# Altium project PressurePulse_Pulse-PCB.PrjPcb
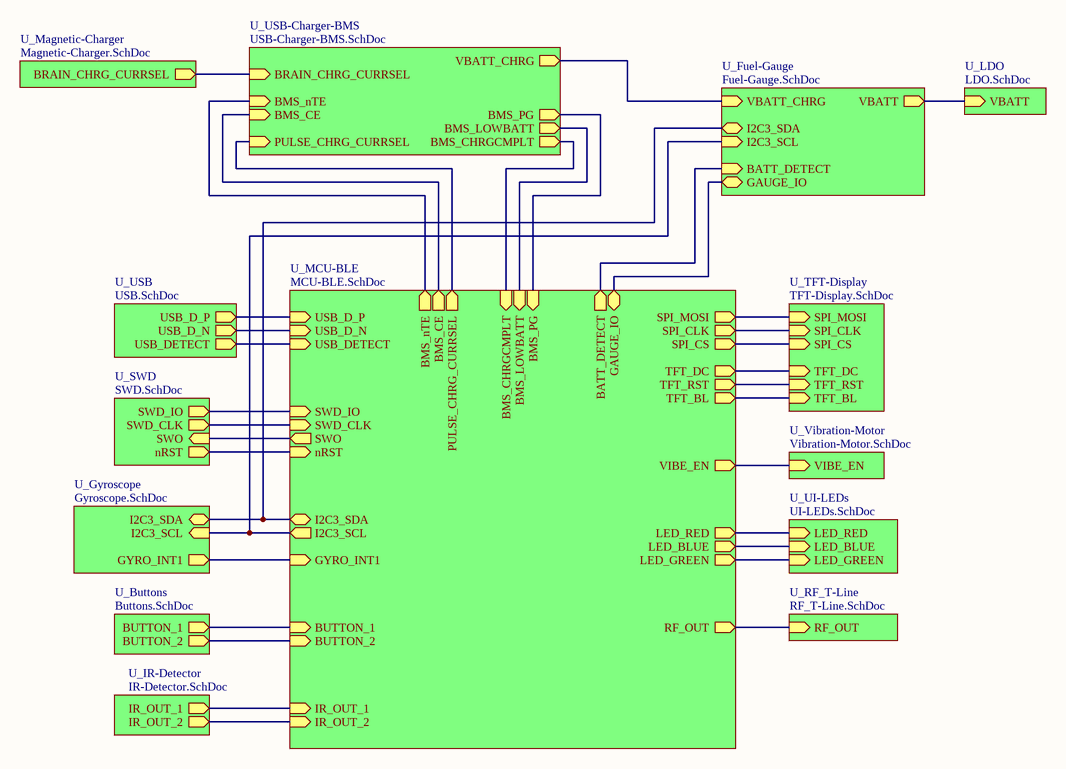
[diagram p0: PressurePulse_Pulse-PCB_Master.SchDoc]
15 sheets, 113 parts. Net scope: hierarchical (ports join the sheet entries above them; power ports are global).
Board file: PressurePulse_Pulse-PCB.PcbDoc
Sheets:
  PressurePulse_Pulse-PCB_Master.SchDoc
    U_USB = USB.SchDoc
    U_USB-Charger-BMS = USB-Charger-BMS.SchDoc
    U_Fuel-Gauge = Fuel-Gauge.SchDoc
    U_LDO = LDO.SchDoc
    U_SWD = SWD.SchDoc
    U_MCU-BLE = MCU-BLE.SchDoc
    U_Vibration-Motor = Vibration-Motor.SchDoc
    U_TFT-Display = TFT-Display.SchDoc
    U_Buttons = Buttons.SchDoc
    U_Magnetic-Charger = Magnetic-Charger.SchDoc
    U_Gyroscope = Gyroscope.SchDoc
    U_UI-LEDs = UI-LEDs.SchDoc
    U_RF_T-Line = RF_T-Line.SchDoc
    U_IR-Detector = IR-Detector.SchDoc

## Sheet PressurePulse_Pulse-PCB_Master.SchDoc
size B; SheetNumber: 1; SheetTotal: 15

### Sub-sheets
U_Buttons = Buttons.SchDoc: BUTTON_1 (out), BUTTON_2 (out)
U_Fuel-Gauge = Fuel-Gauge.SchDoc: I2C3_SCL (in), I2C3_SDA (bidir), GAUGE_IO (bidir), BATT_DETECT (in), VBATT (out), VBATT_CHRG (in)
U_Gyroscope = Gyroscope.SchDoc: I2C3_SDA (bidir), GYRO_INT1 (out), I2C3_SCL (in)
U_IR-Detector = IR-Detector.SchDoc: IR_OUT_1 (out), IR_OUT_2 (out)
U_LDO = LDO.SchDoc: VBATT (in)
U_Magnetic-Charger = Magnetic-Charger.SchDoc: BRAIN_CHRG_CURRSEL (out)
U_MCU-BLE = MCU-BLE.SchDoc: SWO (out), SWD_CLK (in), SWD_IO (in), nRST (in), USB_D_N (in), USB_D_P (in), I2C3_SCL (out), I2C3_SDA (bidir), BMS_PG (in), BMS_LOWBATT (in), BMS_CHRGCMPLT (in), BMS_nTE (out), BMS_CE (out), GAUGE_IO (bidir), BATT_DETECT (out), VIBE_EN (out), PULSE_CHRG_CURRSEL (out), GYRO_INT1 (in), USB_DETECT (in), SPI_CLK (out), SPI_MOSI (out), SPI_CS (out), TFT_RST (out), TFT_DC (out), TFT_BL (out), BUTTON_1 (in), BUTTON_2 (in), LED_RED (out), LED_BLUE (out), RF_OUT (out), LED_GREEN (out), IR_OUT_1 (in), IR_OUT_2 (in)
U_RF_T-Line = RF_T-Line.SchDoc: RF_OUT (in)
U_SWD = SWD.SchDoc: nRST (out), SWD_IO (out), SWD_CLK (out), SWO (in)
U_TFT-Display = TFT-Display.SchDoc: SPI_MOSI (in), SPI_CLK (in), SPI_CS (in), TFT_DC (in), TFT_RST (in), TFT_BL (in)
U_UI-LEDs = UI-LEDs.SchDoc: LED_RED (in), LED_BLUE (in), LED_GREEN (in)
U_USB = USB.SchDoc: USB_D_N (out), USB_D_P (out), USB_DETECT (out)
U_USB-Charger-BMS = USB-Charger-BMS.SchDoc: BMS_PG (out), BMS_LOWBATT (out), BMS_CHRGCMPLT (out), BMS_nTE (in), BMS_CE (in), PULSE_CHRG_CURRSEL (in), BRAIN_CHRG_CURRSEL (in), VBATT_CHRG (out)
U_Vibration-Motor = Vibration-Motor.SchDoc: VIBE_EN (in)

### Nets
BATT_DETECT: sheet U_Fuel-Gauge/BATT_DETECT, sheet U_MCU-BLE/BATT_DETECT
GAUGE_IO: sheet U_Fuel-Gauge/GAUGE_IO, sheet U_MCU-BLE/GAUGE_IO
I2C_SCL: sheet U_Fuel-Gauge/I2C3_SCL, sheet U_MCU-BLE/I2C3_SCL, sheet U_Gyroscope/I2C3_SCL
I2C_SDA: sheet U_Fuel-Gauge/I2C3_SDA, sheet U_MCU-BLE/I2C3_SDA, sheet U_Gyroscope/I2C3_SDA
nRST: sheet U_SWD/nRST, sheet U_MCU-BLE/nRST
SWD_CLK: sheet U_SWD/SWD_CLK, sheet U_MCU-BLE/SWD_CLK
SWD_IO: sheet U_SWD/SWD_IO, sheet U_MCU-BLE/SWD_IO
SWO: sheet U_SWD/SWO, sheet U_MCU-BLE/SWO
USB_D_N: sheet U_USB/USB_D_N, sheet U_MCU-BLE/USB_D_N
USB_D_P: sheet U_USB/USB_D_P, sheet U_MCU-BLE/USB_D_P
NetC1_2: sheet U_USB-Charger-BMS/VBATT_CHRG, sheet U_Fuel-Gauge/VBATT_CHRG
NetC6_2: sheet U_Fuel-Gauge/VBATT, sheet U_LDO/VBATT
NetC18_2: sheet U_MCU-BLE/RF_OUT, sheet U_RF_T-Line/RF_OUT
NetD7_A: sheet U_USB-Charger-BMS/BRAIN_CHRG_CURRSEL, sheet U_Magnetic-Charger/BRAIN_CHRG_CURRSEL
NetD8_A: sheet U_USB-Charger-BMS/PULSE_CHRG_CURRSEL, sheet U_MCU-BLE/PULSE_CHRG_CURRSEL
NetD18_K: sheet U_MCU-BLE/SPI_MOSI, sheet U_TFT-Display/SPI_MOSI
NetD20_K: sheet U_MCU-BLE/SPI_CS, sheet U_TFT-Display/SPI_CS
NetD21_K: sheet U_MCU-BLE/TFT_DC, sheet U_TFT-Display/TFT_DC
NetD22_K: sheet U_MCU-BLE/TFT_RST, sheet U_TFT-Display/TFT_RST
NetD23_K: sheet U_MCU-BLE/TFT_BL, sheet U_TFT-Display/TFT_BL
NetD24_K: sheet U_MCU-BLE/BUTTON_1, sheet U_Buttons/BUTTON_1
NetD25_K: sheet U_MCU-BLE/BUTTON_2, sheet U_Buttons/BUTTON_2
NetJ1_SH1: sheet U_USB/USB_DETECT, sheet U_MCU-BLE/USB_DETECT
NetR4_2: sheet U_MCU-BLE/LED_RED, sheet U_UI-LEDs/LED_RED
NetR13_2: sheet U_MCU-BLE/LED_GREEN, sheet U_UI-LEDs/LED_GREEN
NetR14_2: sheet U_MCU-BLE/LED_BLUE, sheet U_UI-LEDs/LED_BLUE
NetR19_1: sheet U_MCU-BLE/IR_OUT_1, sheet U_IR-Detector/IR_OUT_1
NetR22_1: sheet U_MCU-BLE/IR_OUT_2, sheet U_IR-Detector/IR_OUT_2
NetR29_2: sheet U_MCU-BLE/VIBE_EN, sheet U_Vibration-Motor/VIBE_EN
NetR33_2: sheet U_MCU-BLE/SPI_CLK, sheet U_TFT-Display/SPI_CLK
NetU1_6: sheet U_USB-Charger-BMS/BMS_PG, sheet U_MCU-BLE/BMS_PG
NetU1_7: sheet U_USB-Charger-BMS/BMS_CHRGCMPLT, sheet U_MCU-BLE/BMS_CHRGCMPLT
NetU1_8: sheet U_USB-Charger-BMS/BMS_LOWBATT, sheet U_MCU-BLE/BMS_LOWBATT
NetU1_9: sheet U_USB-Charger-BMS/BMS_nTE, sheet U_MCU-BLE/BMS_nTE
NetU1_17: sheet U_USB-Charger-BMS/BMS_CE, sheet U_MCU-BLE/BMS_CE
NetU4_18: sheet U_MCU-BLE/GYRO_INT1, sheet U_Gyroscope/GYRO_INT1

## Sheet USB.SchDoc
size A; SheetNumber: 2; SheetTotal: 15
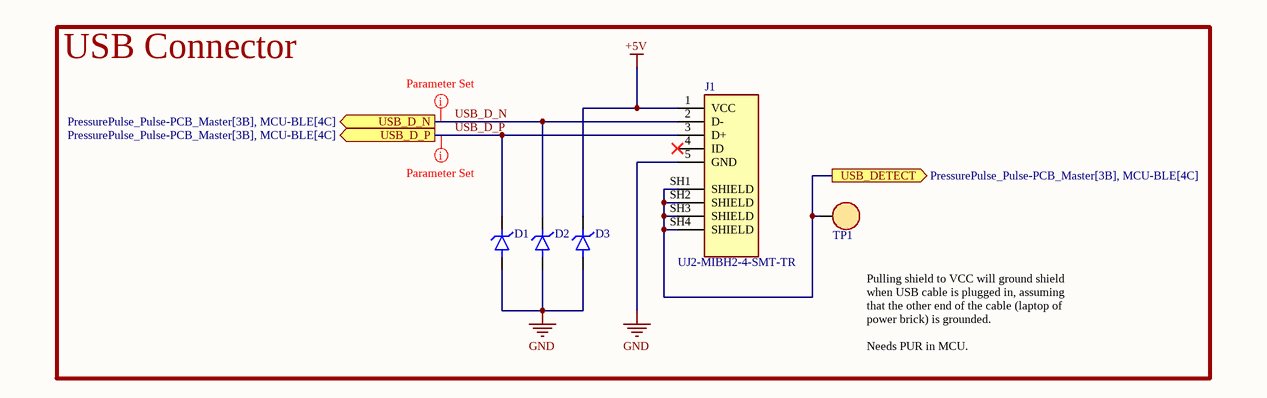
[diagram p1: USB.SchDoc]

### Parts
D1  RCLAMP0521P.TCT  [BDFN2C051V40]  (value not drawn)
D2  RCLAMP0521P.TCT  [BDFN2C051V40]  (value not drawn)
D3  RCLAMP0521P.TCT  [BDFN2C051V40]  (value not drawn)
J1  UJ2-MIBH2-4-SMT-TR  [USB MICRO JLC]
TP1  RH-5019  [TP - RH-5019]  (value not drawn)

### Blocks framed on the sheet
USB Connector: D1-D3 J1 TP1

### Ports
USB_D_N (out, see PressurePulse_Pulse-PCB_Master[3B], MCU-BLE[4C]), USB_D_P (out, see PressurePulse_Pulse-PCB_Master[3B], MCU-BLE[4C]), USB_DETECT (out, see PressurePulse_Pulse-PCB_Master[3B], MCU-BLE[4C])

### Nets
+5V: D3.K J1.1(VCC)
GND: D1.A D2.A D3.A J1.5(GND)
USB_D_N: D2.K J1.2(D-) ; port USB_D_N
USB_D_P: D1.K J1.3(D+) ; port USB_D_P
NetJ1_SH1: J1.SH1(SHIELD) J1.SH2(SHIELD) J1.SH3(SHIELD) J1.SH4(SHIELD) TP1.1 ; port USB_DETECT

Not connected (* = marked no-connect by the designer): J1 4(ID)*

### Layout directives
net class USB: USB_D_N, USB_D_P

### Notes on the sheet
- Pulling shield to VCC will ground shield when USB cable is plugged in, assuming that the other end of the cable (laptop of power brick) is grounded.
  Needs PUR in MCU.

### Library data of the parts
D1-D3 = TVS DIODE: 25V Clamp 4A (8/20µs) Ipp Tvs Diode Surface Mount SLP1006P2; MFR: BORN; Type: SMD; Value: BDFN2C051V40; MFR PN: BDFN2C051V40; JLCPCB PN: C152023
J1 = Micro USB Port: Micro B, USB 2.0, 1.8 A, Right Angle, Surface Mount (SMT), USB Receptacle; MFR: CUI Devices; Value: UA0507065250-037-06; JLCPCB PN: C5249562
TP1 = TEST POINT: MFR: ronghe; MFR PN: RH-5019; Value: RH-5019; JLCPCB PN: C5199800

## Sheet USB-Charger-BMS.SchDoc
size B; SheetNumber: 3; SheetTotal: 15
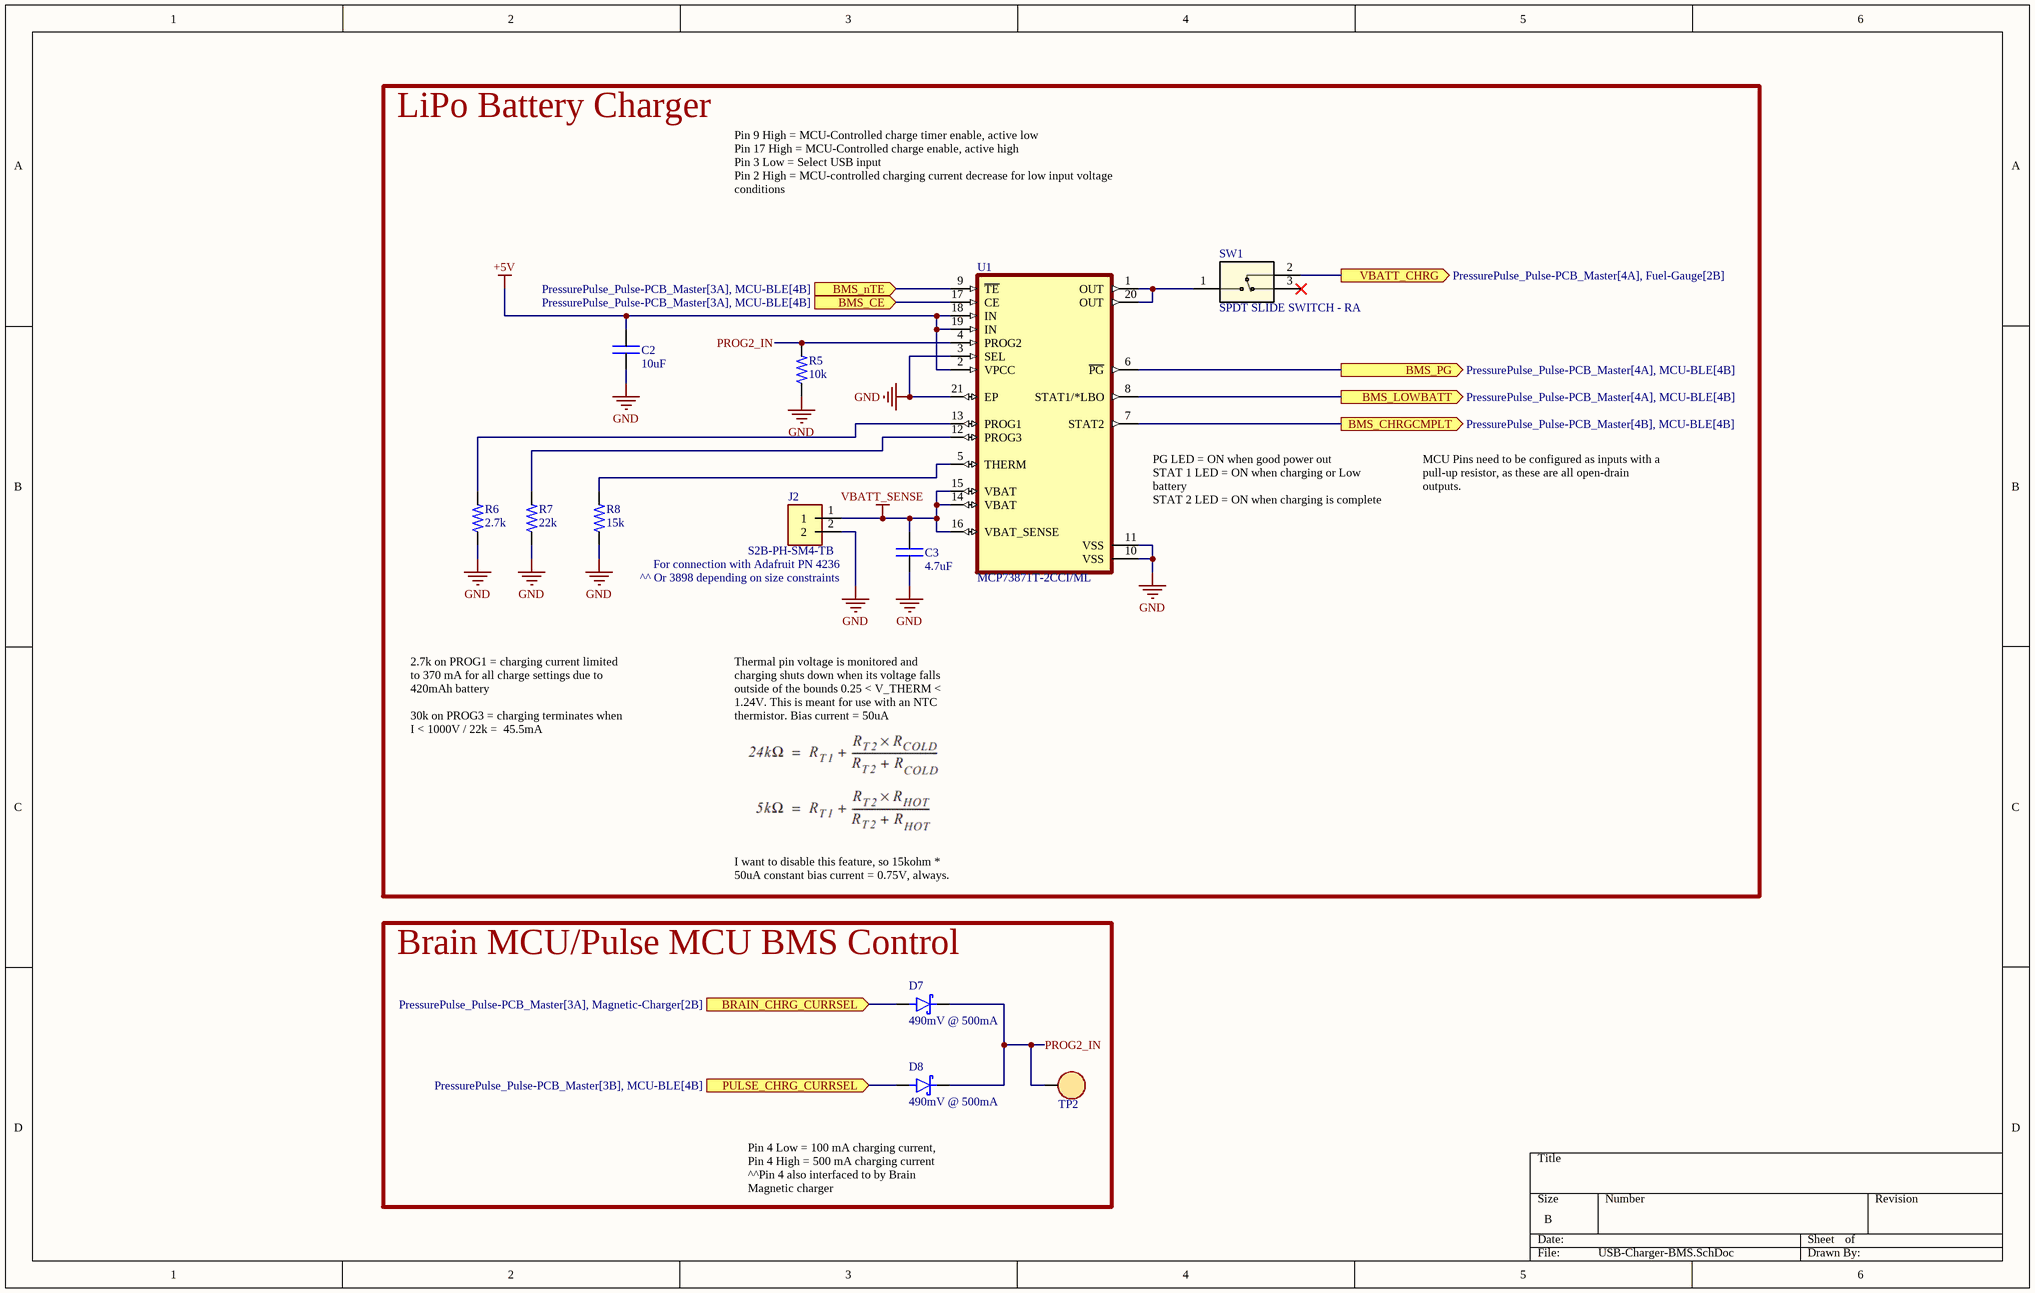
[diagram p2: USB-Charger-BMS.SchDoc]

### Parts
C2  value 10uF  [0402C]  (hidden comment: CAP)
C3  value 4.7uF  [0402C]  (hidden comment: CAP)
D7  490mV @ 500mA  [SOD-523]
D8  490mV @ 500mA  [SOD-523]
J2  S2B-PH-SM4-TB  [JST_PH-2POS-SMT-RA]
R5  value 10k  [0402R]  (hidden comment: RES)
R6  value 2.7k  [0402R]  (hidden comment: RES)
R7  value 22k  [0402R]  (hidden comment: RES)
R8  value 15k  [0402R]  (hidden comment: RES)
SW1  SPDT SLIDE SWITCH - RA  [K3-1290S-J1]
TP2  RH-5019  [TP - RH-5019]  (value not drawn)
U1  MCP73871T-2CCI/ML  [20-VFQFN EXPOSED PAD]

### Blocks framed on the sheet
LiPo Battery Charger: C2 C3 J2 R5-R8 SW1 U1
Brain MCU/Pulse MCU BMS Control: D7 D8 TP2

### Ports
BMS_CE (in, see PressurePulse_Pulse-PCB_Master[3A], MCU-BLE[4B]), BMS_CHRGCMPLT (out, see PressurePulse_Pulse-PCB_Master[4B], MCU-BLE[4B]), BMS_LOWBATT (out, see PressurePulse_Pulse-PCB_Master[4A], MCU-BLE[4B]), BMS_nTE (in, see PressurePulse_Pulse-PCB_Master[3A], MCU-BLE[4B]), BMS_PG (out, see PressurePulse_Pulse-PCB_Master[4A], MCU-BLE[4B]), BRAIN_CHRG_CURRSEL (in, see PressurePulse_Pulse-PCB_Master[3A], Magnetic-Charger[2B]), PULSE_CHRG_CURRSEL (in, see PressurePulse_Pulse-PCB_Master[3B], MCU-BLE[4B]), VBATT_CHRG (out, see PressurePulse_Pulse-PCB_Master[4A], Fuel-Gauge[2B])

### Nets
+5V: C2.2 U1.2(VPCC) U1.18(IN) U1.19(IN)
GND: C2.1 C3.1 J2.2 R5.1 R6.1 R7.1 R8.1 U1.3(SEL) U1.10(VSS) U1.11(VSS) U1.21(EP)
VBATT_SENSE: C3.2 J2.1 U1.14(VBAT) U1.15(VBAT) U1.16(VBAT_SENSE)
PROG2_IN: D7.K D8.K R5.2 TP2.1 U1.4(PROG2)
NetC1_2: SW1.2 ; port VBATT_CHRG
NetD7_A: D7.A ; port BRAIN_CHRG_CURRSEL
NetD8_A: D8.A ; port PULSE_CHRG_CURRSEL
NetR6_2: R6.2 U1.13(PROG1)
NetR7_2: R7.2 U1.12(PROG3)
NetR8_2: R8.2 U1.5(THERM)
NetSW1_1: SW1.1 U1.1(OUT) U1.20(OUT)
NetU1_6: U1.6(~{PG}) ; port BMS_PG
NetU1_7: U1.7(STAT2) ; port BMS_CHRGCMPLT
NetU1_8: U1.8(STAT1/*LBO) ; port BMS_LOWBATT
NetU1_9: U1.9(~{TE}) ; port BMS_nTE
NetU1_17: U1.17(CE) ; port BMS_CE

Not connected (* = marked no-connect by the designer): SW1 3*

### Notes on the sheet
- Pin 9 High = MCU-Controlled charge timer enable, active low
  Pin 17 High = MCU-Controlled charge enable, active high
  Pin 3 Low = Select USB input
  Pin 2 High = MCU-controlled charging current decrease for low input voltage conditions
- (near U1) PG LED = ON when good power out
  STAT 1 LED = ON when charging or Low battery
  STAT 2 LED = ON when charging is complete
- MCU Pins need to be configured as inputs with a pull-up resistor, as these are all open-drain outputs.
- For connection with Adafruit PN 4236
- ^^ Or 3898 depending on size constraints
- 2.7k on PROG1 = charging current limited to 370 mA for all charge settings due to 420mAh battery
  30k on PROG3 = charging terminates when I < 1000V / 22k =  45.5mA
- Thermal pin voltage is monitored and charging shuts down when its voltage falls outside of the bounds 0.25 < V_THERM < 1.24V. This is meant for use with an NTC thermistor. Bias current = 50uA
- I want to disable this feature, so 15kohm * 50uA constant bias current = 0.75V, always.
- Pin 4 Low = 100 mA charging current, Pin 4 High = 500 mA charging current
  ^^Pin 4 also interfaced to by Brain Magnetic charger

### Library data of the parts
C2 C3 = CAP: Capacitor; MFR: *; MFR PN: *; JLCPCB PN: *; Footprint: *
D7 D8 = SCHOTTKY DIODE: MFR: Shikues; MFR PN: MSK4005; Value: MSK4005; JLCPCB PN: C345957
J2 = JST CONN 2POS PH: Connector Header Surface Mount, Right Angle 2 position 0.079 (2.00mm); MFR PN: S2B-PH-SM4-TB(TF)(SN); MFR: JST Sales; Value: S2B-PH-SM4-TB(LF)(SN); Type: SMD; JLCPCB PN: C295747
R5-R8 = RES: Resistor; MFR PN: *; MFR: *; JLCPCB PN: *
SW1 = SPDT SLIDE SWITCH - RA: MFR: Korean Hroparts Elec; Value: K3-1290S-J1; MFR PN: K3-1290S-J1; Type: SMD; JLCPCB PN: C223846
TP2 = TEST POINT: MFR: ronghe; MFR PN: RH-5019; Value: RH-5019; JLCPCB PN: C5199800
U1 = LiPo Batt Charger - Shared load: Charger IC Lithium Ion/Polymer 20-QFN (4x4); MFR: Microchip Technology; MFR PN: MCP73871T-2CCI/ML; Value: MCP73871T-2CCI/ML; JLCPCB PN: C511310

## Sheet Fuel-Gauge.SchDoc
size B; SheetNumber: 4; SheetTotal: 15
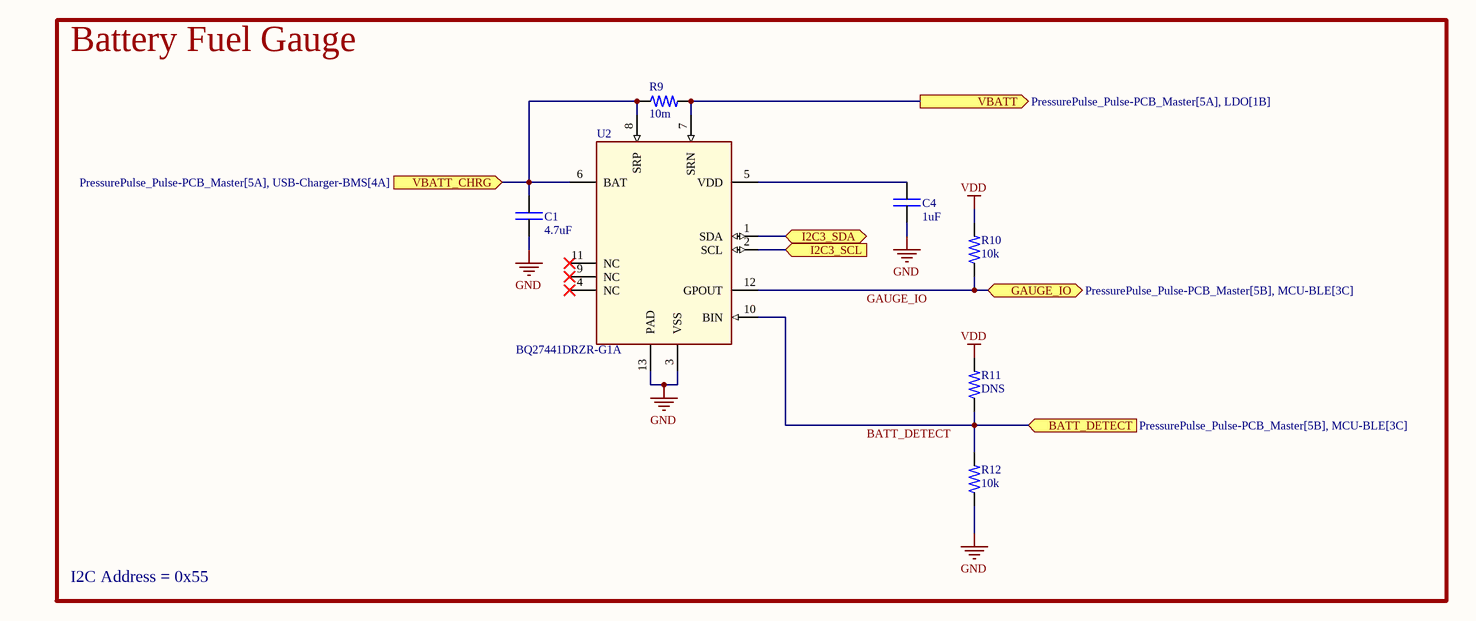
[diagram p3: Fuel-Gauge.SchDoc]

### Parts
C1  value 4.7uF  [0402C]  (hidden comment: CAP)
C4  value 1uF  [0402C]  (hidden comment: CAP)
R9  value 10m  [0805R]  (hidden comment: RES)
R10  value 10k  [0402R]  (hidden comment: RES)
R11  value DNS  [0402R]  (hidden comment: RES)
R12  value 10k  [0402R]  (hidden comment: RES)
U2  BQ27441DRZR-G1A  [bq27441-G1]

### Ports
BATT_DETECT (in, see PressurePulse_Pulse-PCB_Master[5B], MCU-BLE[3C]), GAUGE_IO (bidir, see PressurePulse_Pulse-PCB_Master[5B], MCU-BLE[3C]), I2C3_SCL (in, see PressurePulse_Pulse-PCB_Master[5B], Gyroscope[1C], MCU-BLE[2C]), I2C3_SDA (bidir, see PressurePulse_Pulse-PCB_Master[5A], Gyroscope[1C], MCU-BLE[2C]), VBATT (out, see PressurePulse_Pulse-PCB_Master[5A], LDO[1B]), VBATT_CHRG (in, see PressurePulse_Pulse-PCB_Master[5A], USB-Charger-BMS[4A])

### Nets
GND: C1.1 C4.1 R12.1 U2.3(VSS) U2.13(PAD)
VDD: R10.2 R11.2
BATT_DETECT: R11.1 R12.2 U2.10(BIN) ; port BATT_DETECT
GAUGE_IO: R10.1 U2.12(GPOUT) ; port GAUGE_IO
I2C_SCL: U2.2(SCL) ; port I2C3_SCL
I2C_SDA: U2.1(SDA) ; port I2C3_SDA
NetC1_2: C1.2 R9.1 U2.6(BAT) U2.8(SRP) ; port VBATT_CHRG
NetC4_2: C4.2 U2.5(VDD)
NetC6_2: R9.2 U2.7(SRN) ; port VBATT

Not connected (* = marked no-connect by the designer): U2 4(NC)* 9(NC)* 11(NC)*

### Notes on the sheet
- Battery Fuel Gauge
- I2C Address = 0x55

### Library data of the parts
C1 C4 = CAP: Capacitor; MFR: *; MFR PN: *; JLCPCB PN: *; Footprint: *
R9 = RES: Resistor; MFR PN: RL0805FR-070R01L; MFR: YAGEO; Tolerance: 1%; JLCPCB PN: C728467
R10-R12 = RES: Resistor; MFR PN: *; MFR: *; JLCPCB PN: *
U2 = BATT FUEL GAUGE: No Description Available; MFR: Texas Instruments; Value: BQ27441DRZR-G1A; JLCPCB PN: C473397; MFR PN: BQ27441DRZR-G1A

## Sheet LDO.SchDoc
size A; SheetNumber: 5; SheetTotal: 15
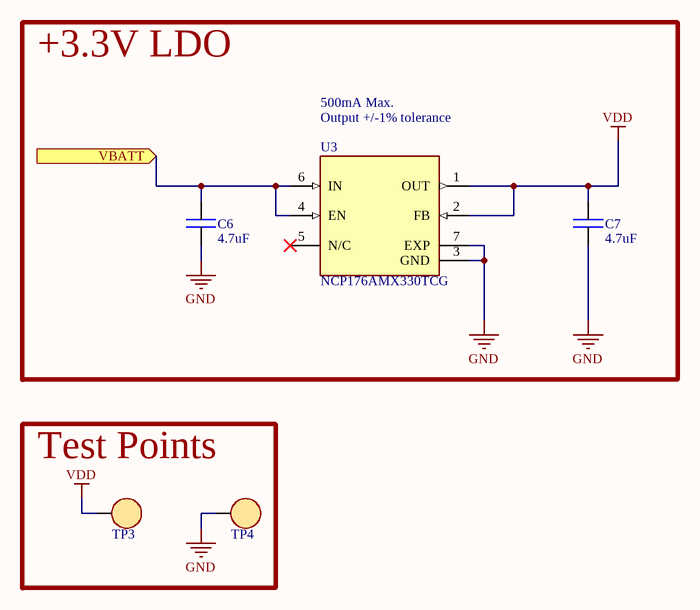
[diagram p4: LDO.SchDoc]

### Parts
C6  value 4.7uF  [0402C]  (hidden comment: CAP)
C7  value 4.7uF  [0402C]  (hidden comment: CAP)
TP3  RH-5019  [TP - RH-5019]  (value not drawn)
TP4  RH-5019  [TP - RH-5019]  (value not drawn)
U3  NCP176AMX330TCG  [6-XDFN]

### Blocks framed on the sheet
+3.3V LDO: C6 C7 U3
Test Points: TP3 TP4

### Ports
VBATT (in, see PressurePulse_Pulse-PCB_Master[5A], Fuel-Gauge[4B])

### Nets
GND: C6.1 C7.1 TP4.1 U3.3(GND) U3.7(EXP)
VDD: C7.2 TP3.1 U3.1(OUT) U3.2(FB)
NetC6_2: C6.2 U3.4(EN) U3.6(IN) ; port VBATT

Not connected (* = marked no-connect by the designer): U3 5(N/C)*

### Notes on the sheet
- 500mA Max.
- Output +/-1% tolerance

### Library data of the parts
C6 C7 = CAP: Capacitor; MFR: *; MFR PN: *; JLCPCB PN: *; Footprint: *
TP3 TP4 = TEST POINT: MFR: ronghe; MFR PN: RH-5019; Value: RH-5019; JLCPCB PN: C5199800
U3 = LDO 3.3V: LDO REGULATOR; MFR: onsemi; MFR PN: NCP176AMX330TCG; Value: NCP176AMX330TCG; JLCPCB PN: C233363

## Sheet SWD.SchDoc
size A; SheetNumber: 7; SheetTotal: 15
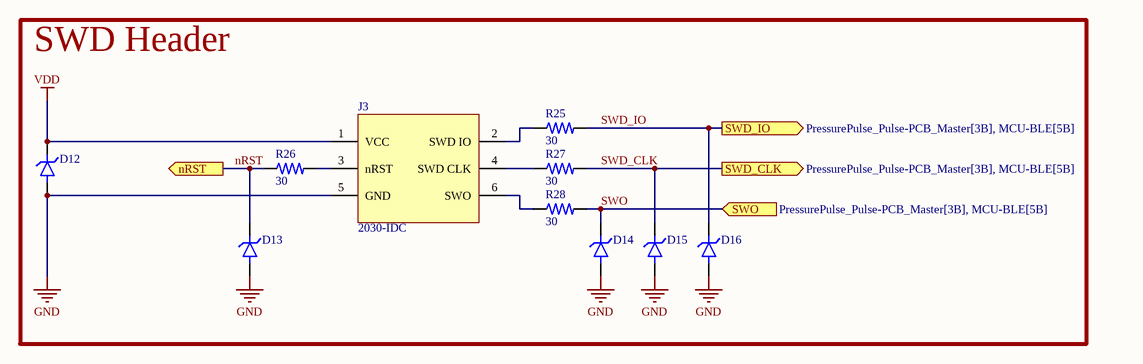
[diagram p5: SWD.SchDoc]

### Parts
D12  RCLAMP0521P.TCT  [BDFN2C051V40]  (value not drawn)
D13  RCLAMP0521P.TCT  [BDFN2C051V40]  (value not drawn)
D14  RCLAMP0521P.TCT  [BDFN2C051V40]  (value not drawn)
D15  RCLAMP0521P.TCT  [BDFN2C051V40]  (value not drawn)
D16  RCLAMP0521P.TCT  [BDFN2C051V40]  (value not drawn)
J3  2030-IDC  [TAG CONNECT TC2030IDC - NO 3D MODEL]
R25  value 30  [0402R]  (hidden comment: RES)
R26  value 30  [0402R]  (hidden comment: RES)
R27  value 30  [0402R]  (hidden comment: RES)
R28  value 30  [0402R]  (hidden comment: RES)

### Blocks framed on the sheet
SWD Header: D12-D16 J3 R25-R28

### Ports
nRST (out, see PressurePulse_Pulse-PCB_Master[3B], MCU-BLE[4C]), SWD_CLK (out, see PressurePulse_Pulse-PCB_Master[3B], MCU-BLE[5B]), SWD_IO (out, see PressurePulse_Pulse-PCB_Master[3B], MCU-BLE[5B]), SWO (in, see PressurePulse_Pulse-PCB_Master[3B], MCU-BLE[5B])

### Nets
GND: D12.A D13.A D14.A D15.A D16.A J3.5(GND)
VDD: D12.K J3.1(VCC)
nRST: D13.K R26.1 ; port nRST
SWD_CLK: D15.K R27.2 ; port SWD_CLK
SWD_IO: D16.K R25.2 ; port SWD_IO
SWO: D14.K R28.2 ; port SWO
NetJ3_2: J3.2(SWD_IO) R25.1
NetJ3_3: J3.3(nRST) R26.2
NetJ3_4: J3.4(SWD_CLK) R27.1
NetJ3_6: J3.6(SWO) R28.1

### Library data of the parts
D12-D16 = TVS DIODE: as D1 on sheet USB; MFR PN: BDFN2C051V40; JLCPCB PN: C152023
J3 = TAG CONNECT 2030-IDC: MFR PN: TC2030-IDC; Value: DNS; MFR: Tag Connect
R25-R28 = RES: Resistor; MFR PN: *; MFR: *; JLCPCB PN: *

## Sheet MCU-BLE.SchDoc
size B; SheetNumber: 6; SheetTotal: 15
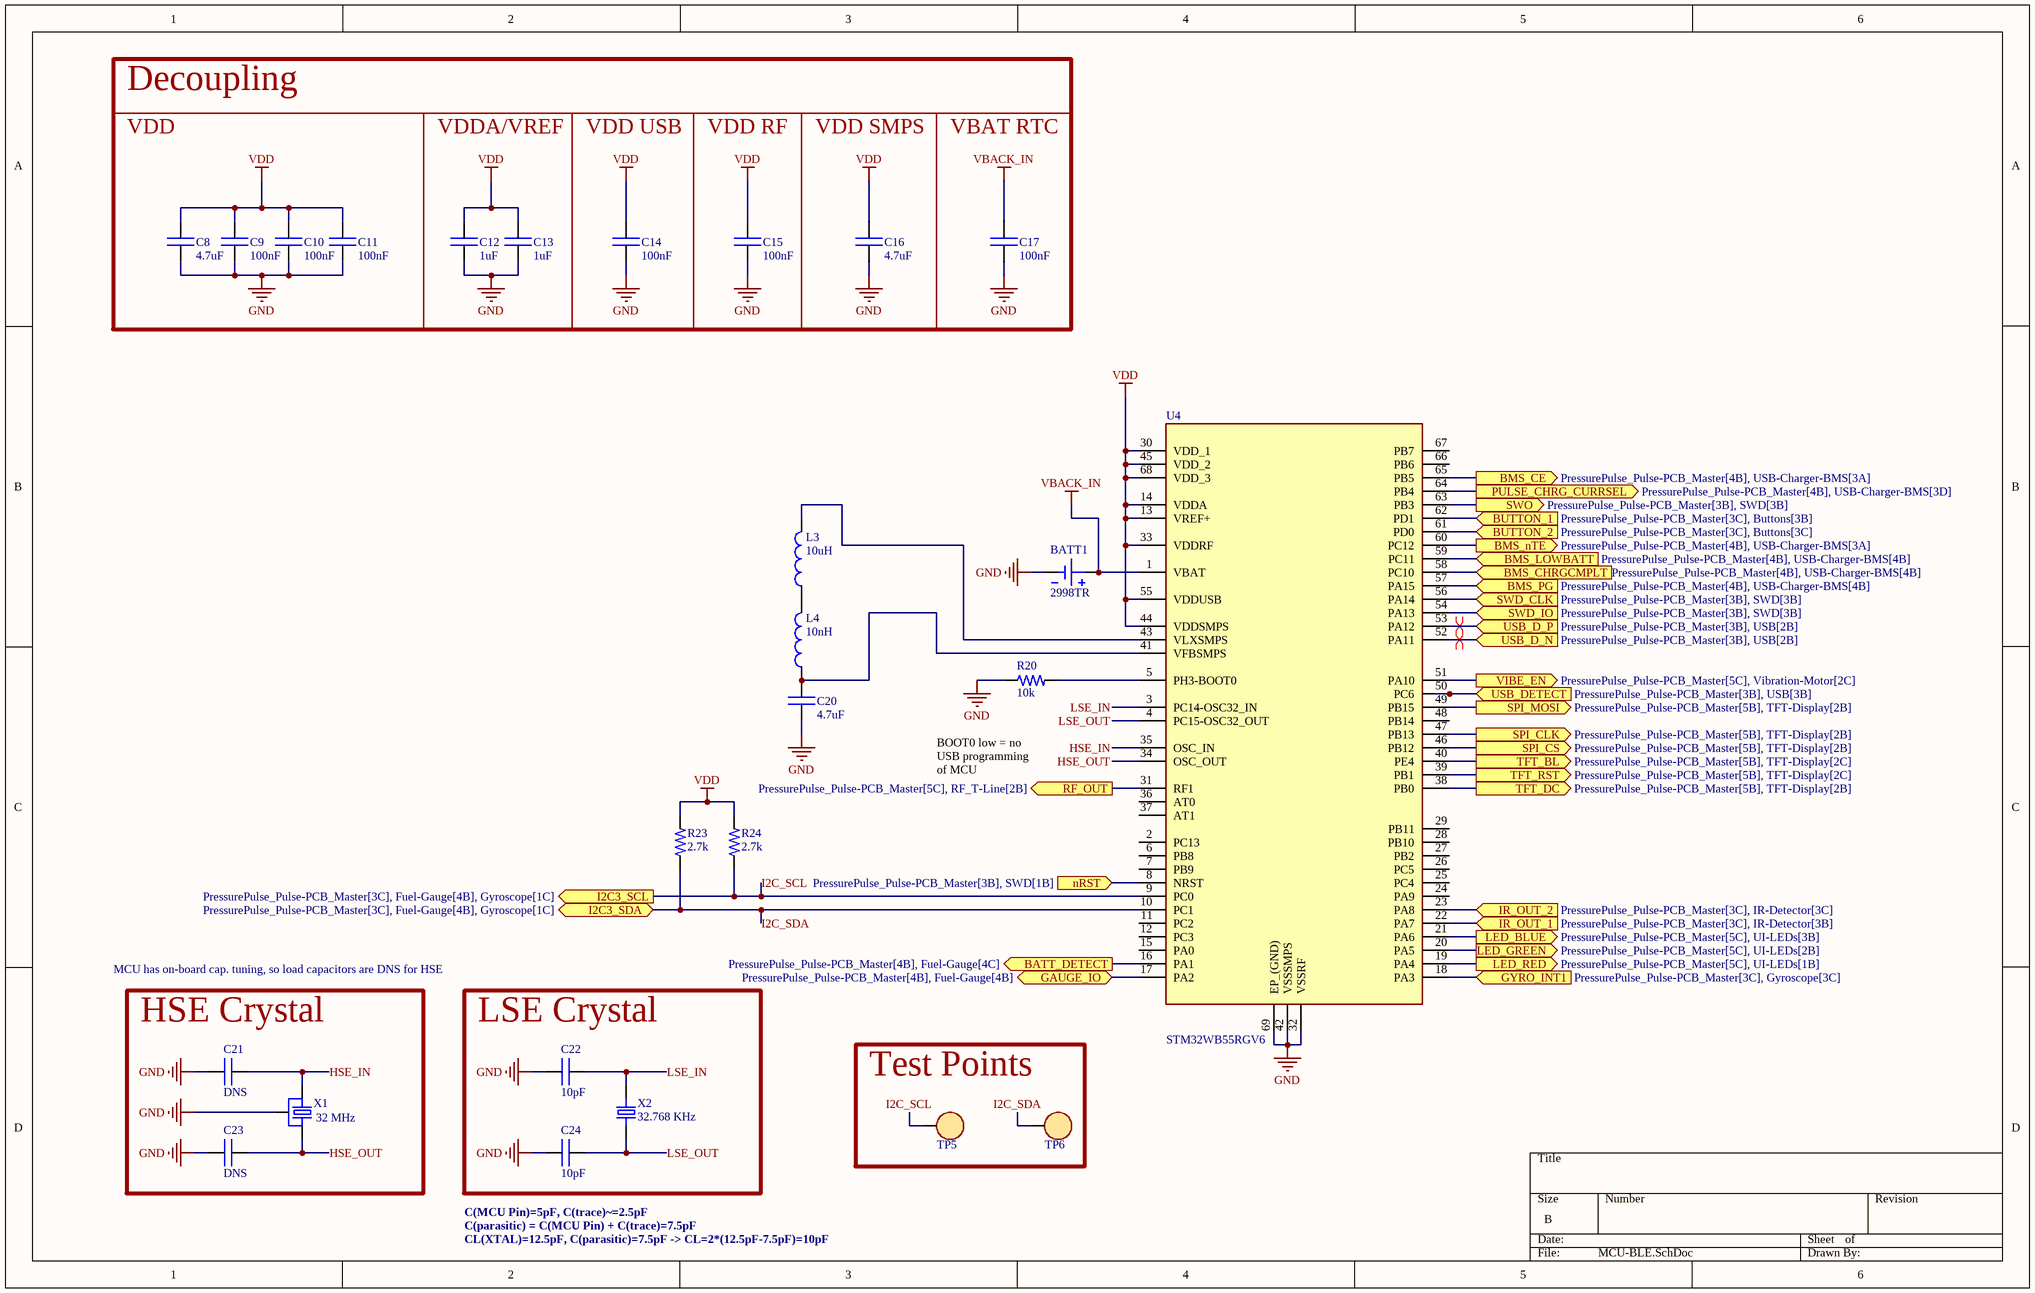
[diagram p6: MCU-BLE.SchDoc]

### Parts
BATT1  2998TR  [SR66]
C8  value 4.7uF  [0402C]  (hidden comment: CAP)
C9  value 100nF  [0402C]  (hidden comment: CAP)
C10  value 100nF  [0402C]  (hidden comment: CAP)
C11  value 100nF  [0402C]  (hidden comment: CAP)
C12  value 1uF  [0402C]  (hidden comment: CAP)
C13  value 1uF  [0402C]  (hidden comment: CAP)
C14  value 100nF  [0402C]  (hidden comment: CAP)
C15  value 100nF  [0402C]  (hidden comment: CAP)
C16  value 4.7uF  [0402C]  (hidden comment: CAP)
C17  value 100nF  [0402C]  (hidden comment: CAP)
C20  value 4.7uF  [0402C]  (hidden comment: CAP)
C21  value DNS  [0402C]  (hidden comment: CAP)
C22  value 10pF  [0402C]  (hidden comment: CAP)
C23  value DNS  [0402C]  (hidden comment: CAP)
C24  value 10pF  [0402C]  (hidden comment: CAP)
L3  value 10uH  [0805L]  (hidden comment: IND)
L4  value 10nH  [0402L]  (hidden comment: IND)
R20  value 10k  [0402R]  (hidden comment: RES)
R23  value 2.7k  [0402R]  (hidden comment: RES)
R24  value 2.7k  [0402R]  (hidden comment: RES)
TP5  RH-5019  [TP - RH-5019]  (value not drawn)
TP6  RH-5019  [TP - RH-5019]  (value not drawn)
U4  STM32WB55RGV6  [VQFN-68]
X1  Frequency: 32 MHz  [32MHZ_SMD1612-4P]  (hidden comment: XTAL-OSC_32MHz)
X2  Frequency: 32.768 KHz  [XTAL_ECS-.327-12.5-34B-TR]  (hidden comment: XTAL-OSC_32.768kHz)

### Blocks framed on the sheet
Decoupling: C8-C11
VDDA/VREF: C12 C13
VDD USB: C14
VDD RF: C15
VDD SMPS: C16
VBAT RTC: C17
HSE Crystal: C21 C23 X1
LSE Crystal: C22 C24 X2
Test Points: TP5 TP6

### Ports
BATT_DETECT (out, see PressurePulse_Pulse-PCB_Master[4B], Fuel-Gauge[4C]), BMS_CE (out, see PressurePulse_Pulse-PCB_Master[4B], USB-Charger-BMS[3A]), BMS_CHRGCMPLT (in, see PressurePulse_Pulse-PCB_Master[4B], USB-Charger-BMS[4B]), BMS_LOWBATT (in, see PressurePulse_Pulse-PCB_Master[4B], USB-Charger-BMS[4B]), BMS_nTE (out, see PressurePulse_Pulse-PCB_Master[4B], USB-Charger-BMS[3A]), BMS_PG (in, see PressurePulse_Pulse-PCB_Master[4B], USB-Charger-BMS[4B]), BUTTON_1 (in, see PressurePulse_Pulse-PCB_Master[3C], Buttons[3B]), BUTTON_2 (in, see PressurePulse_Pulse-PCB_Master[3C], Buttons[3C]), GAUGE_IO (bidir, see PressurePulse_Pulse-PCB_Master[4B], Fuel-Gauge[4B]), GYRO_INT1 (in, see PressurePulse_Pulse-PCB_Master[3C], Gyroscope[3C]), I2C3_SCL (out, see PressurePulse_Pulse-PCB_Master[3C], Fuel-Gauge[4B], Gyroscope[1C]), I2C3_SDA (bidir, see PressurePulse_Pulse-PCB_Master[3C], Fuel-Gauge[4B], Gyroscope[1C]), IR_OUT_1 (in, see PressurePulse_Pulse-PCB_Master[3C], IR-Detector[3B]), IR_OUT_2 (in, see PressurePulse_Pulse-PCB_Master[3C], IR-Detector[3C]), LED_BLUE (out, see PressurePulse_Pulse-PCB_Master[5C], UI-LEDs[3B]), LED_GREEN (out, see PressurePulse_Pulse-PCB_Master[5C], UI-LEDs[2B]), LED_RED (out, see PressurePulse_Pulse-PCB_Master[5C], UI-LEDs[1B]), nRST (in, see PressurePulse_Pulse-PCB_Master[3B], SWD[1B]), PULSE_CHRG_CURRSEL (out, see PressurePulse_Pulse-PCB_Master[4B], USB-Charger-BMS[3D]), RF_OUT (out, see PressurePulse_Pulse-PCB_Master[5C], RF_T-Line[2B]), SPI_CLK (out, see PressurePulse_Pulse-PCB_Master[5B], TFT-Display[2B]), SPI_CS (out, see PressurePulse_Pulse-PCB_Master[5B], TFT-Display[2B]), SPI_MOSI (out, see PressurePulse_Pulse-PCB_Master[5B], TFT-Display[2B]), SWD_CLK (in, see PressurePulse_Pulse-PCB_Master[3B], SWD[3B]), SWD_IO (in, see PressurePulse_Pulse-PCB_Master[3B], SWD[3B]), SWO (out, see PressurePulse_Pulse-PCB_Master[3B], SWD[3B]), TFT_BL (out, see PressurePulse_Pulse-PCB_Master[5B], TFT-Display[2C]), TFT_DC (out, see PressurePulse_Pulse-PCB_Master[5B], TFT-Display[2B]), TFT_RST (out, see PressurePulse_Pulse-PCB_Master[5B], TFT-Display[2C]), USB_D_N (in, see PressurePulse_Pulse-PCB_Master[3B], USB[2B]), USB_D_P (in, see PressurePulse_Pulse-PCB_Master[3B], USB[2B]), USB_DETECT (in, see PressurePulse_Pulse-PCB_Master[3B], USB[3B]), VIBE_EN (out, see PressurePulse_Pulse-PCB_Master[5C], Vibration-Motor[2C])

### Nets
GND: BATT1.N(NEG) C8.1 C9.1 C10.1 C11.1 C12.1 C13.1 C14.1 C15.1 C16.1 C17.1 C20.1 C21.2 C22.2 C23.2 C24.2 R20.1 U4.32(VSSRF) U4.42(VSSSMPS) U4.69(EP_(GND)) X1.GND
VBACK_IN: BATT1.P(POS) C17.2 U4.1(VBAT)
VDD: C8.2 C9.2 C10.2 C11.2 C12.2 C13.2 C14.2 C15.2 C16.2 R23.2 R24.2 U4.13(VREF+) U4.14(VDDA) U4.30(VDD_1) U4.33(VDDRF) U4.44(VDDSMPS) U4.45(VDD_2) U4.55(VDDUSB) U4.68(VDD_3)
BATT_DETECT: U4.16(PA1) ; port BATT_DETECT
GAUGE_IO: U4.17(PA2) ; port GAUGE_IO
HSE_IN: C21.1 U4.35(OSC_IN) X1.1
HSE_OUT: C23.1 U4.34(OSC_OUT) X1.3
I2C_SCL: R24.1 TP5.1 U4.9(PC0) ; port I2C3_SCL
I2C_SDA: R23.1 TP6.1 U4.10(PC1) ; port I2C3_SDA
LSE_IN: C22.1 U4.3(PC14-OSC32_IN) X2.2
LSE_OUT: C24.1 U4.4(PC15-OSC32_OUT) X2.1
nRST: U4.8(NRST) ; port nRST
SWD_CLK: U4.56(PA14) ; port SWD_CLK
SWD_IO: U4.54(PA13) ; port SWD_IO
SWO: U4.63(PB3) ; port SWO
USB_D_N: U4.52(PA11) ; port USB_D_N
USB_D_P: U4.53(PA12) ; port USB_D_P
NetC18_2: U4.31(RF1) ; port RF_OUT
NetC20_2: C20.2 L4.1 U4.41(VFBSMPS)
NetD8_A: U4.64(PB4) ; port PULSE_CHRG_CURRSEL
NetD18_K: U4.49(PB15) ; port SPI_MOSI
NetD20_K: U4.46(PB12) ; port SPI_CS
NetD21_K: U4.38(PB0) ; port TFT_DC
NetD22_K: U4.39(PB1) ; port TFT_RST
NetD23_K: U4.40(PE4) ; port TFT_BL
NetD24_K: U4.62(PD1) ; port BUTTON_1
NetD25_K: U4.61(PD0) ; port BUTTON_2
NetJ1_SH1: U4.50(PC6) ; port USB_DETECT
NetL3_1: L3.1 L4.2
NetL3_2: L3.2 U4.43(VLXSMPS)
NetR4_2: U4.19(PA4) ; port LED_RED
NetR13_2: U4.20(PA5) ; port LED_GREEN
NetR14_2: U4.21(PA6) ; port LED_BLUE
NetR19_1: U4.22(PA7) ; port IR_OUT_1
NetR20_2: R20.2 U4.5(PH3-BOOT0)
NetR22_1: U4.23(PA8) ; port IR_OUT_2
NetR29_2: U4.51(PA10) ; port VIBE_EN
NetR33_2: U4.47(PB13) ; port SPI_CLK
NetU1_6: U4.57(PA15) ; port BMS_PG
NetU1_7: U4.58(PC10) ; port BMS_CHRGCMPLT
NetU1_8: U4.59(PC11) ; port BMS_LOWBATT
NetU1_9: U4.60(PC12) ; port BMS_nTE
NetU1_17: U4.65(PB5) ; port BMS_CE
NetU4_18: U4.18(PA3) ; port GYRO_INT1

Not connected (* = marked no-connect by the designer): U4 2(PC13) 6(PB8) 7(PB9) 11(PC2) 12(PC3) 15(PA0) 24(PA9) 25(PC4) 26(PC5) 27(PB2) 28(PB10) 29(PB11) 36(AT0) 37(AT1) 48(PB14) 66(PB6) 67(PB7)

### Layout directives
differential pair: USB_D_N, USB_D_P

### Notes on the sheet
- VDD
- BOOT0 low = no USB programming of MCU
- MCU has on-board cap. tuning, so load capacitors are DNS for HSE
- CL(XTAL)=12.5pF, C(parasitic)=7.5pF -> CL=2*(12.5pF-7.5pF)=10pF
- C(MCU Pin)=5pF, C(trace)~=2.5pF
- C(parasitic) = C(MCU Pin) + C(trace)=7.5pF

### Library data of the parts
BATT1 = COIN CELL BATT - SR66: Battery Holder (Open) Coin, 6.8mm, 1 Cell PC Pin; MFR: Keystone Electronics; Value: DNS; MFR PN: 2998TR; JLCPCB PN: DNS
C8-C17 C20 C21 C23 = CAP: Capaicitor; MFR: *; MFR PN: *
C22 C24 = CAP: Capaicitor; MFR PN: FN15N100J500PNG; MFR: *; JLCPCB PN: C328913
L3 L4 = IND: INDUCTOR; Footprint: *
  L4: JLCPCB PN: C963995
R20 R23 R24 = RES: Resistor; MFR PN: *; MFR: *; JLCPCB PN: *
TP5 TP6 = TEST POINT: MFR: ronghe; MFR PN: RH-5019; Value: RH-5019; JLCPCB PN: C5199800
U4 = STM32WB55RGV6: ARM Microcontrollers - MCU Ultra-low-power dual core Arm Cortex-M4 MCU 64 MHz, Cortex-M0 32MHz with 1 Mbyte Flash, BLE, 802.15.4, USB, LCD, AES-256; MFR: STMicroelectronics; Value: STM32WB55RGV6; JLCPCB PN: C401505; Footprint: *
X1 = XTAL-OSC_32MHz: SMD Tuning Fork Crystal; MFR PN: Murata; Value: XRCMD32M000FXP50R0; Type: SMD; JLCPCB PN: C341820
X2 = XTAL-OSC_32.768kHz: 32.768kHz 12.5pF ±20ppm SMD3215-2P  Crystals ROHS; MFR: CITIZEN; MFR PN: CM315D32768DZFT; Value: CM315D32768DZFT; JLCPCB PN: C182057

## Sheet Vibration-Motor.SchDoc
size A; SheetNumber: 8; SheetTotal: 15
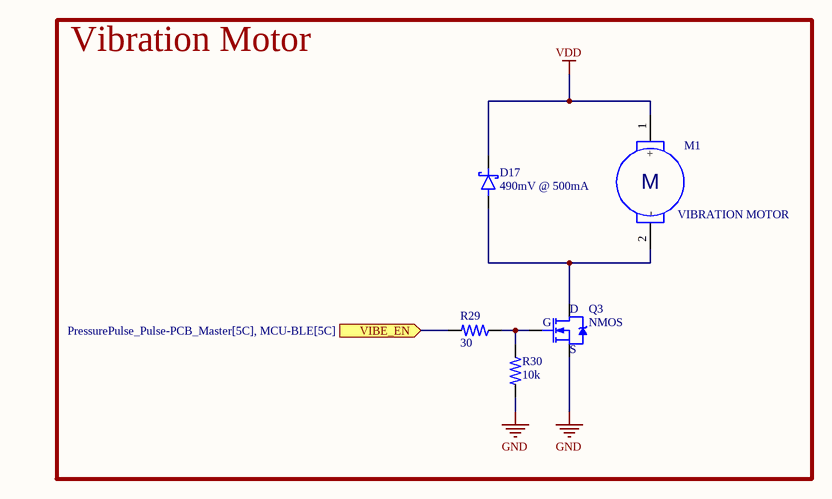
[diagram p7: Vibration-Motor.SchDoc]

### Parts
D17  490mV @ 500mA  [SOD-523]
M1  VIBRATION MOTOR  [BARE PADS - 2]
Q3  NMOS  [SOT-23]
R29  value 30  [0402R]  (hidden comment: RES)
R30  value 10k  [0402R]  (hidden comment: RES)

### Blocks framed on the sheet
Vibration Motor: D17 M1 Q3 R29 R30

### Ports
VIBE_EN (in, see PressurePulse_Pulse-PCB_Master[5C], MCU-BLE[5C])

### Nets
GND: Q3.S R30.2
VDD: D17.K M1.1(+)
NetD17_A: D17.A M1.2(-) Q3.D
NetQ3_G: Q3.G R29.1 R30.1
NetR29_2: R29.2 ; port VIBE_EN

### Notes on the sheet
- (in symbol VIBRATION MOTOR) M

### Library data of the parts
D17 = SCHOTTKY DIODE: as D7 on sheet USB-Charger-BMS; JLCPCB PN: C345957
M1 = VIBRATION MOTOR: 9000rpm Coin Type Vibration Motor 3V -  Vibration Motor ROHS; MFR: LEADER; MFR PN: LCM0827A3038F; Value: LCM0827A3038F; JLCPCB PN: C2759981
Q3 = NMOS: 100V 1.6A 1.3W 220mΩ@10V,1.6A N Channel SOT-23  MOSFETs ROHS; MFR: Infineon; Value: IRLML0100TRPBF; MFR PN: IRLML0100TRPBF; JLCPCB PN: C53658
R29 R30 = RES: Resistor; MFR PN: *; MFR: *; JLCPCB PN: *

## Sheet TFT-Display.SchDoc
size A; SheetNumber: 9; SheetTotal: 15
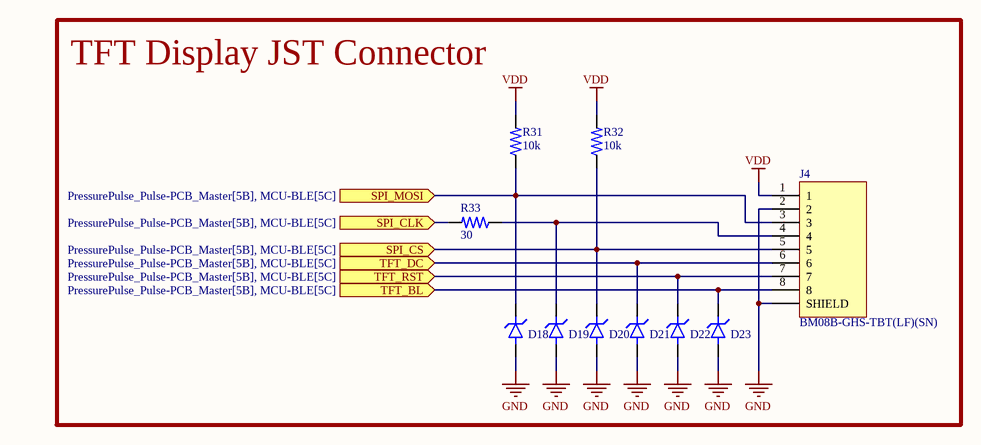
[diagram p8: TFT-Display.SchDoc]

### Parts
D18  BDFN2C051V40  [BDFN2C051V40]  (value not drawn)
D19  BDFN2C051V40  [BDFN2C051V40]  (value not drawn)
D20  BDFN2C051V40  [BDFN2C051V40]  (value not drawn)
D21  BDFN2C051V40  [BDFN2C051V40]  (value not drawn)
D22  BDFN2C051V40  [BDFN2C051V40]  (value not drawn)
D23  BDFN2C051V40  [BDFN2C051V40]  (value not drawn)
J4  BM08B-GHS-TBT(LF)(SN)  [JST_BM08B-GHS-TBT(LF)(SN)(N)]
R31  value 10k  [0402R]  (hidden comment: RES)
R32  value 10k  [0402R]  (hidden comment: RES)
R33  value 30  [0402R]  (hidden comment: RES)

### Blocks framed on the sheet
TFT Display JST Connector: D18-D23 J4 R31-R33

### Ports
SPI_CLK (in, see PressurePulse_Pulse-PCB_Master[5B], MCU-BLE[5C]), SPI_CS (in, see PressurePulse_Pulse-PCB_Master[5B], MCU-BLE[5C]), SPI_MOSI (in, see PressurePulse_Pulse-PCB_Master[5B], MCU-BLE[5C]), TFT_BL (in, see PressurePulse_Pulse-PCB_Master[5B], MCU-BLE[5C]), TFT_DC (in, see PressurePulse_Pulse-PCB_Master[5B], MCU-BLE[5C]), TFT_RST (in, see PressurePulse_Pulse-PCB_Master[5B], MCU-BLE[5C])

### Nets
GND: D18.A D19.A D20.A D21.A D22.A D23.A J4.2 J4.SHIELD
VDD: J4.1 R31.2 R32.2
NetD18_K: D18.K J4.3 R31.1 ; port SPI_MOSI
NetD19_K: D19.K J4.4 R33.1
NetD20_K: D20.K J4.5 R32.1 ; port SPI_CS
NetD21_K: D21.K J4.6 ; port TFT_DC
NetD22_K: D22.K J4.7 ; port TFT_RST
NetD23_K: D23.K J4.8 ; port TFT_BL
NetR33_2: R33.2 ; port SPI_CLK

### Library data of the parts
D18-D23 = TVS DIODE: 25V Clamp 4A (8/20µs) Ipp Tvs Diode Surface Mount SLP1006P2; MFR: BORN; Type: SMD; MFR PN: BDFN2C051V40; Value: BDFN2C051V40; JLCPCB PN: C152023
J4 = JST CONN 8POS GH: Connector Header Surface Mount 8 position 0.049 _1.25mm_; MFR: JST Sales; Value: BM08B-GHS-TBT(LF)(SN); MFR PN: BM08B-GHS-TBT(LF)(SN); JLCPCB PN: C133062
R31-R33 = RES: Resistor; MFR PN: *; MFR: *; JLCPCB PN: *

## Sheet Buttons.SchDoc
size A; SheetNumber: 10; SheetTotal: 15
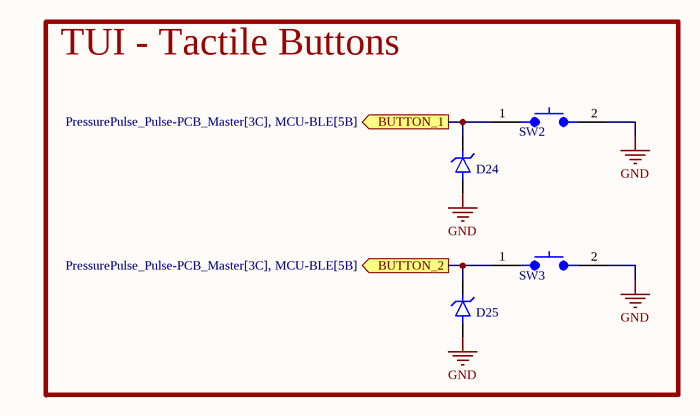
[diagram p9: Buttons.SchDoc]

### Parts
D24  BDFN2C051V40  [BDFN2C051V40]  (value not drawn)
D25  BDFN2C051V40  [BDFN2C051V40]  (value not drawn)
SW2  SPST SMT Tactile Push Button Switch  [TL3302BF180QJ]  (value not drawn)
SW3  SPST SMT Tactile Push Button Switch  [TL3302BF180QJ]  (value not drawn)

### Blocks framed on the sheet
TUI - Tactile Buttons: D24 D25 SW2 SW3

### Ports
BUTTON_1 (out, see PressurePulse_Pulse-PCB_Master[3C], MCU-BLE[5B]), BUTTON_2 (out, see PressurePulse_Pulse-PCB_Master[3C], MCU-BLE[5B])

### Nets
GND: D24.A D25.A SW2.2 SW3.2
NetD24_K: D24.K SW2.1 ; port BUTTON_1
NetD25_K: D25.K SW3.1 ; port BUTTON_2

### Library data of the parts
D24 D25 = TVS DIODE: as D18 on sheet TFT-Display; MFR PN: BDFN2C051V40; Value: BDFN2C051V40; JLCPCB PN: C152023
SW2 SW3 = SPST SMT Tactile Push Button Switch: MFR: E-Switch; Value: DNS; MFR PN: TL3302BF180QJ; JLCPCB PN: DNS

## Sheet Magnetic-Charger.SchDoc
size A; SheetNumber: 11; SheetTotal: 15
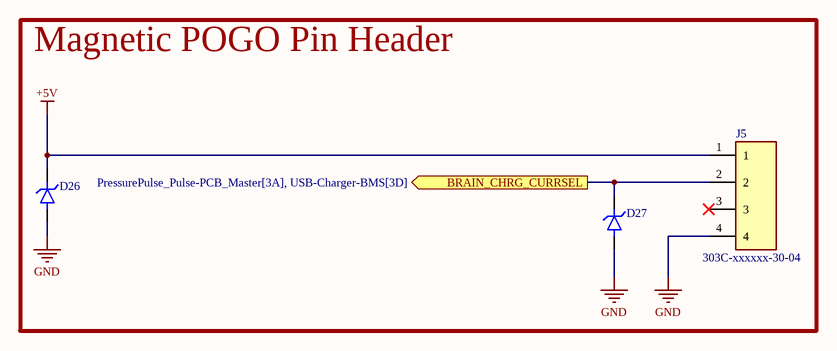
[diagram p10: Magnetic-Charger.SchDoc]

### Parts
D26  RCLAMP0521P.TCT  [BDFN2C051V40]  (value not drawn)
D27  RCLAMP0521P.TCT  [BDFN2C051V40]  (value not drawn)
J5  303C-xxxxxx-30-04  [MAG POGO - 4 POS MALE]

### Blocks framed on the sheet
Magnetic POGO Pin Header: D26 D27 J5

### Ports
BRAIN_CHRG_CURRSEL (out, see PressurePulse_Pulse-PCB_Master[3A], USB-Charger-BMS[3D])

### Nets
+5V: D26.K J5.1
GND: D26.A D27.A J5.4
NetD7_A: D27.K J5.2 ; port BRAIN_CHRG_CURRSEL

Not connected (* = marked no-connect by the designer): J5 3*

### Library data of the parts
D26 D27 = TVS DIODE: as D1 on sheet USB; MFR PN: BDFN2C051V40; JLCPCB PN: C152023
J5 = 303C-xxxxxx-30-04: MAGNETIC POGO 4POS; MFR: ATTEND Technology; MFR PN: 303C-321018-30-04; Value: DNS; JLCPCB PN: *

## Sheet Gyroscope.SchDoc
size A; SheetNumber: 12; SheetTotal: 12
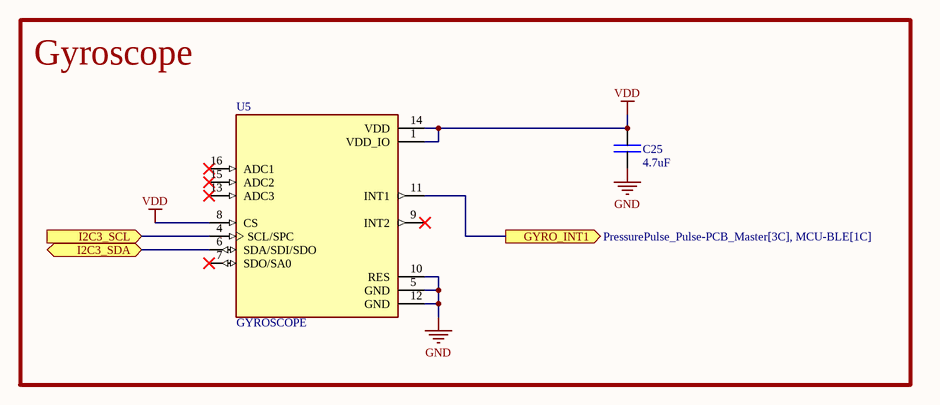
[diagram p11: Gyroscope.SchDoc]

### Parts
C25  value 4.7uF  [0402C]  (hidden comment: CAP)
U5  GYROSCOPE  [16-VFLGA]

### Blocks framed on the sheet
Gyroscope: C25 U5

### Ports
GYRO_INT1 (out, see PressurePulse_Pulse-PCB_Master[3C], MCU-BLE[1C]), I2C3_SCL (in, see PressurePulse_Pulse-PCB_Master[3C], Fuel-Gauge[4B], MCU-BLE[3C]), I2C3_SDA (bidir, see PressurePulse_Pulse-PCB_Master[3C], Fuel-Gauge[4B], MCU-BLE[3C])

### Nets
GND: C25.1 U5.5(GND) U5.10(RES) U5.12(GND)
VDD: C25.2 U5.1(VDD_IO) U5.8(CS) U5.14(VDD)
I2C_SCL: U5.4(SCL/SPC) ; port I2C3_SCL
I2C_SDA: U5.6(SDA/SDI/SDO) ; port I2C3_SDA
NetU4_18: U5.11(INT1) ; port GYRO_INT1

Not connected (* = marked no-connect by the designer): U5 7(SDO/SA0)* 9(INT2)* 13(ADC3)* 15(ADC2)* 16(ADC1)*

### Library data of the parts
C25 = CAP: Capacitor; MFR: *; MFR PN: *; JLCPCB PN: *; Footprint: *
U5 = GYROSCOPE: Accelerometer X, Y, Z Axis Â±2g, 4g, 8g, 16g 0.5Hz ~ 625Hz 16-LGA (3x3); MFR: STMicroelectronics; Value: LIS3DHTR; MFR PN: LIS3DHTR; JLCPCB PN: C15134

## Sheet UI-LEDs.SchDoc
size A; SheetNumber: 13; SheetTotal: 15
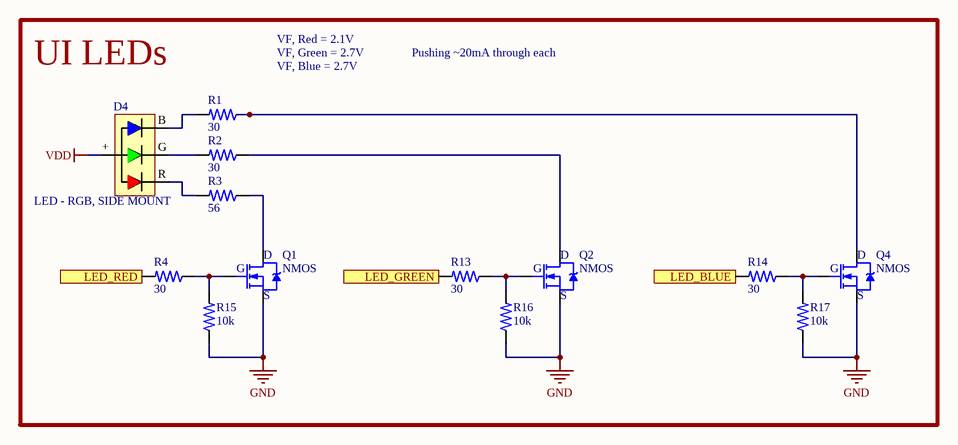
[diagram p12: UI-LEDs.SchDoc]

### Parts
D4  LED - RGB, SIDE MOUNT  [FM-3510RGBA-SG]
Q1  NMOS  [SOT-23]
Q2  NMOS  [SOT-23]
Q4  NMOS  [SOT-23]
R1  value 30  [0402R]  (hidden comment: RES)
R2  value 30  [0402R]  (hidden comment: RES)
R3  value 56  [0402R]  (hidden comment: RES)
R4  value 30  [0402R]  (hidden comment: RES)
R13  value 30  [0402R]  (hidden comment: RES)
R14  value 30  [0402R]  (hidden comment: RES)
R15  value 10k  [0402R]  (hidden comment: RES)
R16  value 10k  [0402R]  (hidden comment: RES)
R17  value 10k  [0402R]  (hidden comment: RES)

### Ports
LED_BLUE (in, see PressurePulse_Pulse-PCB_Master[5C], MCU-BLE[4C]), LED_GREEN (in, see PressurePulse_Pulse-PCB_Master[5C], MCU-BLE[4C]), LED_RED (in, see PressurePulse_Pulse-PCB_Master[5C], MCU-BLE[4C])

### Nets
GND: Q1.S Q2.S Q4.S R15.1 R16.1 R17.1
VDD: D4.+
NetD4_B: D4.B R1.2
NetD4_G: D4.G R2.2
NetD4_R: D4.R R3.2
NetQ1_D: Q1.D R3.1
NetQ1_G: Q1.G R4.1 R15.2
NetQ2_D: Q2.D R2.1
NetQ2_G: Q2.G R13.1 R16.2
NetQ4_D: Q4.D R1.1
NetQ4_G: Q4.G R14.1 R17.2
NetR4_2: R4.2 ; port LED_RED
NetR13_2: R13.2 ; port LED_GREEN
NetR14_2: R14.2 ; port LED_BLUE

### Notes on the sheet
- UI LEDs
- VF, Red = 2.1V
- VF, Green = 2.7V
- VF, Blue = 2.7V
- Pushing ~20mA through each

### Library data of the parts
D4 = LED - RGB, SIDE MOUNT: MFR: Foshan NationStar Optoelectronics; Value: FM-3510RGBA-SG; MFR PN: FM-3510RGBA-SG; JLCPCB PN: C727903
Q1 Q2 Q4 = NMOS: as Q3 on sheet Vibration-Motor; MFR PN: IRLML0100TRPBF; JLCPCB PN: C53658
R1-R4 R13-R17 = RES: Resistor; MFR PN: *; MFR: *
  R1 R2 R4 R13-R17: JLCPCB PN: *
  R3: JLCPCB PN: C103102

## Sheet RF_T-Line.SchDoc
size A; SheetNumber: 14; SheetTotal: 15
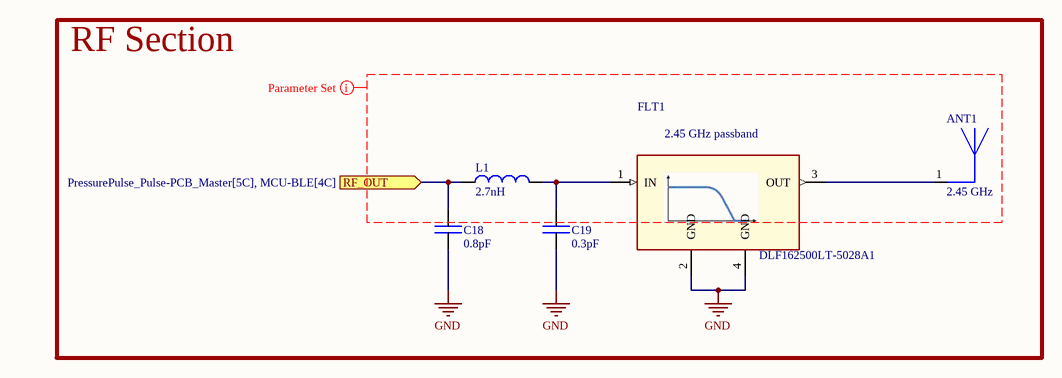
[diagram p13: RF_T-Line.SchDoc]

### Parts
ANT1  Center Frequency: 2.45 GHz  [ANTC5220X130N]  (hidden comment: CHIP ANTENNA)
C18  value 0.8pF  [0603C]  (hidden comment: CAP)
C19  value 0.3pF  [0402C]  (hidden comment: CAP)
FLT1  DLF162500LT-5028A1  [DLF-4_1P6X0P8]
L1  value 2.7nH  [0402L]  (hidden comment: IND)

### Blocks framed on the sheet
RF Section: ANT1 C18 C19 FLT1 L1

### Ports
RF_OUT (in, see PressurePulse_Pulse-PCB_Master[5C], MCU-BLE[4C])

### Nets
GND: C18.1 C19.1 FLT1.2(GND) FLT1.4(GND)
NetANT1_1: ANT1.1 FLT1.3(OUT)
NetC18_2: C18.2 L1.1 ; port RF_OUT
NetC19_2: C19.2 FLT1.1(IN) L1.2

### Layout directives
net class RF: (no net found under the mark)

### Notes on the sheet
- (in symbol 2.45GHz LPF) 2.45 GHz passband

### Library data of the parts
ANT1 = CHIP ANTENNA: MFR: Pulse Electronics; MFR PN: ANT7020LL05R2400A; Value: DNS; JLCPCB PN: *
C18 C19 = CAP: Capacitor; MFR: *; MFR PN: *
  C18: JLCPCB PN: C507057; Footprint: 0603
  C19: JLCPCB PN: C2986289; Footprint: *
FLT1 = 2.45GHz LPF: RF FILTER LOW PASS 2.45GHZ 0603; MFR: TDK; MFR PN: DLF162500LT-5028A1; Value: DLF162500LT-5028A1; JLCPCB PN: C531364
L1 = IND: INDUCTOR; JLCPCB PN: C963981; Footprint: *

## Sheet IR-Detector.SchDoc
size A; SheetNumber: 15; SheetTotal: 15
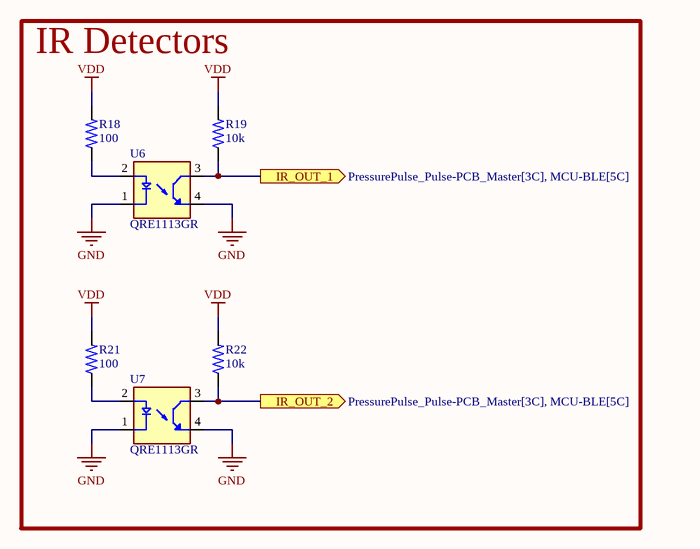
[diagram p14: IR-Detector.SchDoc]

### Parts
R18  value 100  [0402R]  (hidden comment: RES)
R19  value 10k  [0402R]  (hidden comment: RES)
R21  value 100  [0402R]  (hidden comment: RES)
R22  value 10k  [0402R]  (hidden comment: RES)
U6  QRE1113GR  [SMD-4P]
U7  QRE1113GR  [SMD-4P]

### Blocks framed on the sheet
IR Detectors: R18 R19 R21 R22 U6 U7

### Ports
IR_OUT_1 (out, see PressurePulse_Pulse-PCB_Master[3C], MCU-BLE[5C]), IR_OUT_2 (out, see PressurePulse_Pulse-PCB_Master[3C], MCU-BLE[5C])

### Nets
GND: U6.1(A) U6.4(ET) U7.1(A) U7.4(ET)
VDD: R18.2 R19.2 R21.2 R22.2
NetR18_1: R18.1 U6.2(C)
NetR19_1: R19.1 U6.3(CT) ; port IR_OUT_1
NetR21_1: R21.1 U7.2(C)
NetR22_1: R22.1 U7.3(CT) ; port IR_OUT_2

### Library data of the parts
R18 R19 R21 R22 = RES: Resistor; MFR PN: *; MFR: *; JLCPCB PN: *
U6 U7 = IR DETECTOR: Reflective Optical Sensor 0.039 (1mm) 4-SMD, Gull Wing; MFR: ON Semiconductor; JLCPCB PN: C232862; Value: QRE1113GR; MFR PN: QRE1113GR

## Nets that join several sheets
+5V: USB (D3.K J1.1), USB-Charger-BMS (C2.2 U1.2 U1.18 U1.19), Magnetic-Charger (D26.K J5.1)
GND: USB (D1.A D2.A D3.A J1.5), USB-Charger-BMS (11 pins), Fuel-Gauge (5 pins), LDO (5 pins), SWD (6 pins), MCU-BLE (21 pins), Vibration-Motor (Q3.S R30.2), TFT-Display (8 pins), Buttons (D24.A D25.A SW2.2 SW3.2), Magnetic-Charger (D26.A D27.A J5.4), Gyroscope (C25.1 U5.5 U5.10 U5.12), UI-LEDs (6 pins), RF_T-Line (C18.1 C19.1 FLT1.2 FLT1.4), IR-Detector (U6.1 U6.4 U7.1 U7.4)
VDD: Fuel-Gauge (R10.2 R11.2), LDO (C7.2 TP3.1 U3.1 U3.2), SWD (D12.K J3.1), MCU-BLE (19 pins), Vibration-Motor (D17.K M1.1), TFT-Display (J4.1 R31.2 R32.2), Gyroscope (C25.2 U5.1 U5.8 U5.14), UI-LEDs (D4.+), IR-Detector (R18.2 R19.2 R21.2 R22.2)
BATT_DETECT: Fuel-Gauge (R11.1 R12.2 U2.10), MCU-BLE (U4.16)
GAUGE_IO: Fuel-Gauge (R10.1 U2.12), MCU-BLE (U4.17)
I2C_SCL: Fuel-Gauge (U2.2), MCU-BLE (R24.1 TP5.1 U4.9), Gyroscope (U5.4)
I2C_SDA: Fuel-Gauge (U2.1), MCU-BLE (R23.1 TP6.1 U4.10), Gyroscope (U5.6)
NetC1_2: USB-Charger-BMS (SW1.2), Fuel-Gauge (C1.2 R9.1 U2.6 U2.8)
NetC6_2: Fuel-Gauge (R9.2 U2.7), LDO (C6.2 U3.4 U3.6)
NetC18_2: MCU-BLE (U4.31), RF_T-Line (C18.2 L1.1)
NetD7_A: USB-Charger-BMS (D7.A), Magnetic-Charger (D27.K J5.2)
NetD8_A: USB-Charger-BMS (D8.A), MCU-BLE (U4.64)
NetD18_K: MCU-BLE (U4.49), TFT-Display (D18.K J4.3 R31.1)
NetD20_K: MCU-BLE (U4.46), TFT-Display (D20.K J4.5 R32.1)
NetD21_K: MCU-BLE (U4.38), TFT-Display (D21.K J4.6)
NetD22_K: MCU-BLE (U4.39), TFT-Display (D22.K J4.7)
NetD23_K: MCU-BLE (U4.40), TFT-Display (D23.K J4.8)
NetD24_K: MCU-BLE (U4.62), Buttons (D24.K SW2.1)
NetD25_K: MCU-BLE (U4.61), Buttons (D25.K SW3.1)
NetJ1_SH1: USB (5 pins), MCU-BLE (U4.50)
NetR4_2: MCU-BLE (U4.19), UI-LEDs (R4.2)
NetR13_2: MCU-BLE (U4.20), UI-LEDs (R13.2)
NetR14_2: MCU-BLE (U4.21), UI-LEDs (R14.2)
NetR19_1: MCU-BLE (U4.22), IR-Detector (R19.1 U6.3)
NetR22_1: MCU-BLE (U4.23), IR-Detector (R22.1 U7.3)
NetR29_2: MCU-BLE (U4.51), Vibration-Motor (R29.2)
NetR33_2: MCU-BLE (U4.47), TFT-Display (R33.2)
NetU1_6: USB-Charger-BMS (U1.6), MCU-BLE (U4.57)
NetU1_7: USB-Charger-BMS (U1.7), MCU-BLE (U4.58)
NetU1_8: USB-Charger-BMS (U1.8), MCU-BLE (U4.59)
NetU1_9: USB-Charger-BMS (U1.9), MCU-BLE (U4.60)
NetU1_17: USB-Charger-BMS (U1.17), MCU-BLE (U4.65)
NetU4_18: MCU-BLE (U4.18), Gyroscope (U5.11)
nRST: SWD (D13.K R26.1), MCU-BLE (U4.8)
SWD_CLK: SWD (D15.K R27.2), MCU-BLE (U4.56)
SWD_IO: SWD (D16.K R25.2), MCU-BLE (U4.54)
SWO: SWD (D14.K R28.2), MCU-BLE (U4.63)
USB_D_N: USB (D2.K J1.2), MCU-BLE (U4.52)
USB_D_P: USB (D1.K J1.3), MCU-BLE (U4.53)